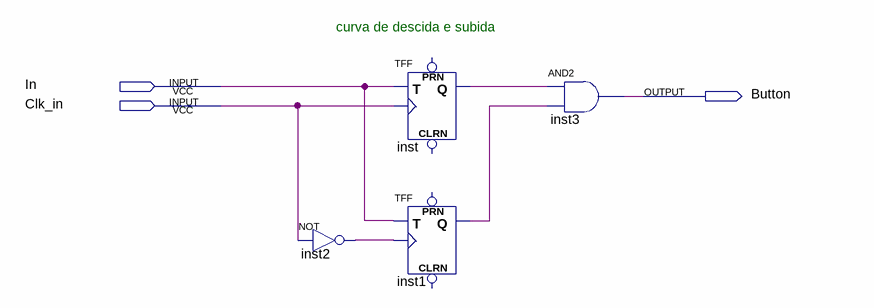
[diagram p0: schematic sheet]
// Quartus schematic debounce.bdf as structural Verilog: 4 symbols, 3 pins
module debounce (
  input  In,
  input  Clk_in,
  output Button
);

  wire inst1_q, inst2_out, inst_q;

  not inst2 (inst2_out, Clk_in);
  TFF inst (.T(In), .CLK(Clk_in), .Q(inst_q));  // open: PRN, CLRN
  TFF inst1 (.T(In), .CLK(inst2_out), .Q(inst1_q));  // open: PRN, CLRN
  and inst3 (Button, inst_q, inst1_q);

  // Notes on the sheet:
  //   curva de descida e subida
endmodule
